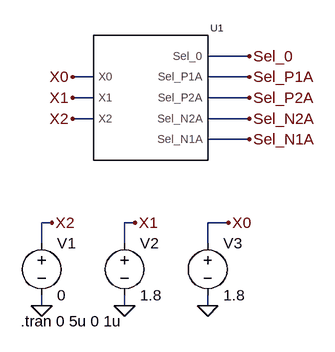
[diagram p0: schematic Booth_Encoder_Test.asc]
Booth_Encoder_Test.asc, the LTspice schematic file:
Version 4.1
SHEET 1 880 680
WIRE 320 80 256 80
WIRE 80 112 48 112
WIRE 320 112 256 112
WIRE 80 144 48 144
WIRE 320 144 256 144
WIRE 80 176 48 176
WIRE 320 176 256 176
WIRE 320 208 256 208
WIRE 16 336 0 336
WIRE 144 336 128 336
WIRE 288 336 256 336
WIRE 0 368 0 336
WIRE 128 368 128 336
WIRE 256 368 256 336
WIRE 0 464 0 448
WIRE 128 464 128 448
WIRE 256 464 256 448
FLAG 48 112 X0
FLAG 48 144 X1
FLAG 48 176 X2
FLAG 320 80 Sel_0
FLAG 320 112 Sel_P1A
FLAG 320 144 Sel_P2A
FLAG 320 176 Sel_N2A
FLAG 320 208 Sel_N1A
FLAG 0 464 0
FLAG 128 464 0
FLAG 256 464 0
FLAG 288 336 X0
FLAG 144 336 X1
FLAG 16 336 X2
SYMBOL Encoder 176 176 R0
SYMATTR InstName U1
SYMBOL voltage 0 352 R0
WINDOW 123 0 0 Left 0
WINDOW 39 0 0 Left 0
SYMATTR InstName V1
SYMATTR Value 0
SYMBOL voltage 128 352 R0
WINDOW 123 0 0 Left 0
WINDOW 39 0 0 Left 0
SYMATTR InstName V2
SYMATTR Value 1.8
SYMBOL voltage 256 352 R0
WINDOW 123 0 0 Left 0
WINDOW 39 0 0 Left 0
SYMATTR InstName V3
SYMATTR Value 1.8
TEXT -32 488 Left 2 !.tran 0 5u 0 1u

The netlist it stands for:
* Booth_Encoder_Test.asc
X§U1 X0 X1 X2 Sel_0 Sel_P1A Sel_P2A Sel_N2A Sel_N1A Encoder  ; pins X0 X1 X2 Sel_0 Sel_P1A Sel_P2A Sel_N2A Sel_N1A
V1 X2 0 0
V2 X1 0 1.8
V3 X0 0 1.8
.tran 0 5u 0 1u
.lib Encoder.sub
.backanno
.end